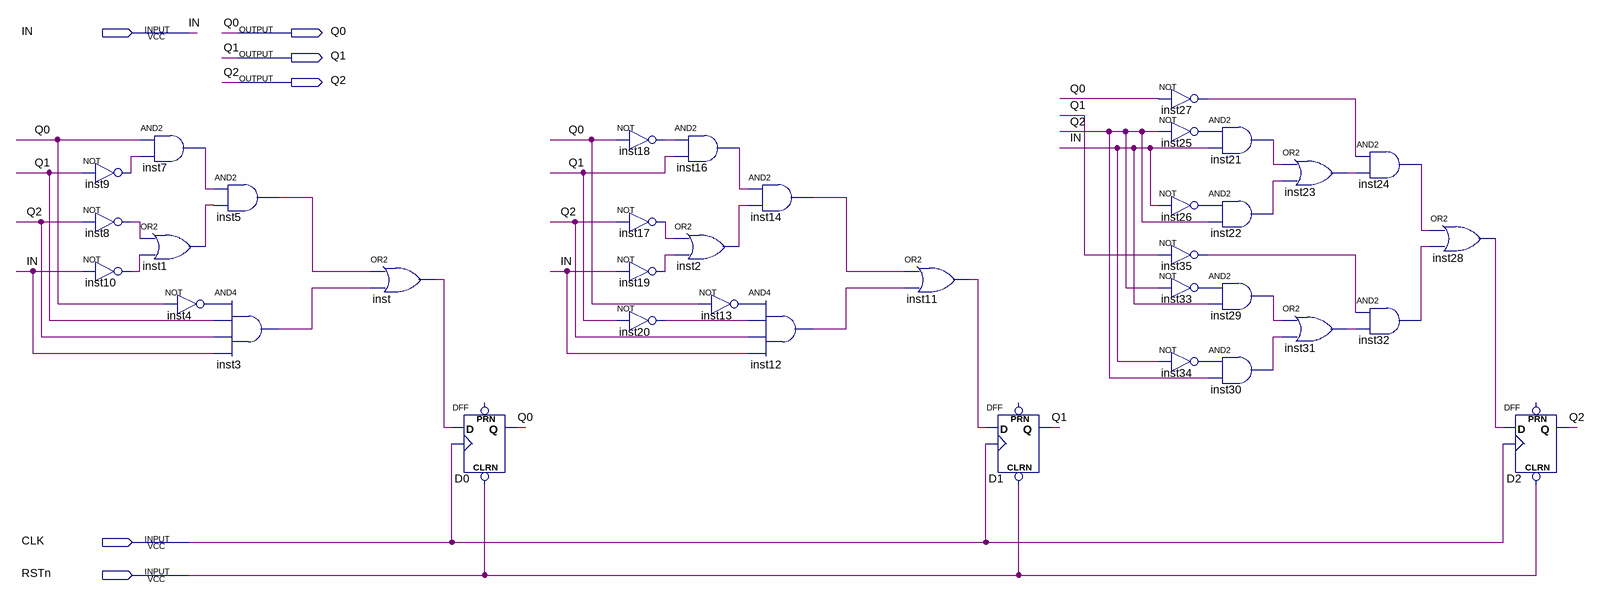
[diagram p0: schematic sheet]
// Quartus schematic Estado.bdf as structural Verilog: 37 symbols, 6 pins
module Estado (
  input  IN,
  input  CLK,
  input  RSTn,
  output Q0,
  output Q1,
  output Q2
);

  wire inst1_out, inst2_out, inst3_out, inst4_out, inst5_out, inst7_out, inst8_out, inst9_out, inst10_out,
       inst11_out, inst12_out, inst13_out, inst14_out, inst16_out, inst17_out, inst18_out, inst19_out,
       inst20_out, inst21_out, inst22_out, inst23_out, inst24_out, inst25_out, inst26_out, inst27_out,
       inst28_out, inst29_out, inst30_out, inst31_out, inst32_out, inst33_out, inst34_out, inst35_out,
       inst_out;

  not inst9 (inst9_out, Q1);
  not inst8 (inst8_out, Q2);
  not inst10 (inst10_out, IN);
  and inst7 (inst7_out, Q0, inst9_out);
  or inst1 (inst1_out, inst8_out, inst10_out);
  and inst5 (inst5_out, inst7_out, inst1_out);
  and inst3 (inst3_out, inst4_out, Q1, Q2, IN);
  not inst4 (inst4_out, Q0);
  or inst (inst_out, inst5_out, inst3_out);
  DFF D0 (.CLRN(RSTn), .CLK(CLK), .D(inst_out), .Q(Q0));  // open: PRN
  and inst16 (inst16_out, inst18_out, Q1);
  not inst18 (inst18_out, Q0);
  not inst17 (inst17_out, Q2);
  or inst2 (inst2_out, inst17_out, inst19_out);
  not inst19 (inst19_out, IN);
  not inst20 (inst20_out, Q1);
  not inst13 (inst13_out, Q0);
  and inst14 (inst14_out, inst16_out, inst2_out);
  and inst12 (inst12_out, inst13_out, inst20_out, Q2, IN);
  or inst11 (inst11_out, inst14_out, inst12_out);
  DFF D1 (.CLRN(RSTn), .CLK(CLK), .D(inst11_out), .Q(Q1));  // open: PRN
  not inst27 (inst27_out, Q0);
  not inst25 (inst25_out, Q2);
  not inst26 (inst26_out, IN);
  not inst35 (inst35_out, Q1);
  not inst33 (inst33_out, Q2);
  not inst34 (inst34_out, IN);
  and inst21 (inst21_out, inst25_out, IN);
  and inst22 (inst22_out, inst26_out, Q2);
  and inst29 (inst29_out, inst33_out, IN);
  and inst30 (inst30_out, inst34_out, Q2);
  or inst23 (inst23_out, inst21_out, inst22_out);
  or inst31 (inst31_out, inst29_out, inst30_out);
  and inst24 (inst24_out, inst27_out, inst23_out);
  and inst32 (inst32_out, inst35_out, inst31_out);
  or inst28 (inst28_out, inst24_out, inst32_out);
  DFF D2 (.CLRN(RSTn), .CLK(CLK), .D(inst28_out), .Q(Q2));  // open: PRN
endmodule
